# EAGLE design cd4007 (EAGLE 6.6.0)
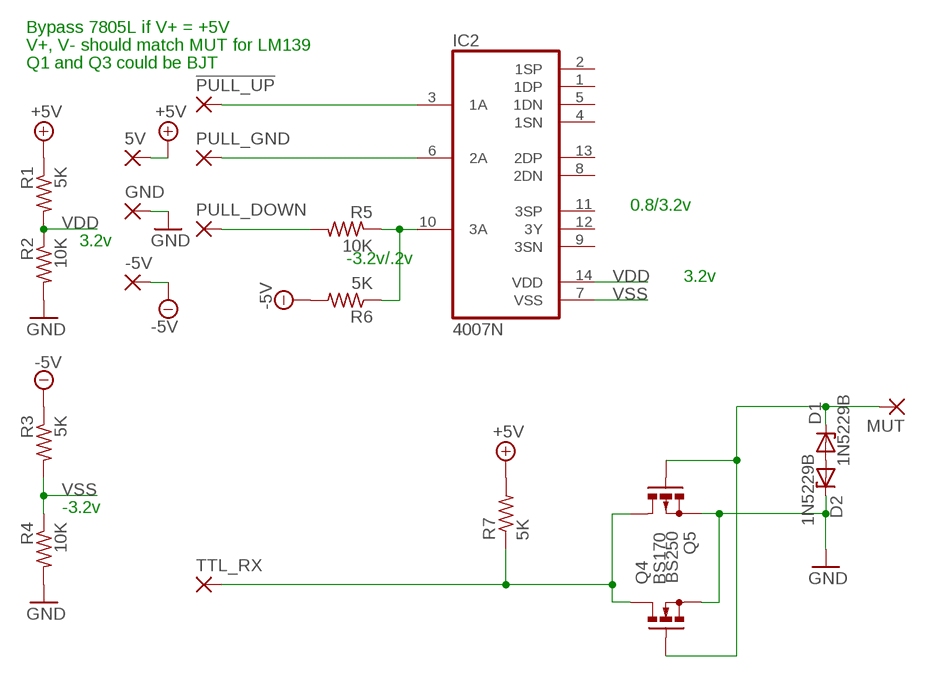
[diagram p0: schematic, sheet 1]

## Parts
5V  1,6/0,9  [1,6/0,9]
!PULL_UP  1,6/0,9  [1,6/0,9]
-5V  1,6/0,9  [1,6/0,9]
D1  1N5229B  ZENER-DIODEDO35Z10  [DO35Z10]
D2  1N5229B  ZENER-DIODEDO35Z10  [DO35Z10]
GND  1,6/0,9  [1,6/0,9]
IC2  4007N  [DIL14]
MUT  1,6/0,9  [1,6/0,9]
PULL_DOWN  1,6/0,9  [1,6/0,9]
PULL_GND  1,6/0,9  [1,6/0,9]
Q4  BS170  [SOT54E]
Q5  BS250  [SOT54E]
R1  5K  R-US_0207/10  [0207/10]
R2  10K  R-US_0207/10  [0207/10]
R3  5K  R-US_0207/10  [0207/10]
R4  10K  R-US_0207/10  [0207/10]
R5  10K  R-US_0207/10  [0207/10]
R6  5K  R-US_0207/10  [0207/10]
R7  5K  R-US_0207/10  [0207/10]
TTL_RX  1,6/0,9  [1,6/0,9]

## Nets
+5V: 5V.1(P) R1.1 R7.2
-5V: -5V.1(P) R3.1 R6.2
GND: D2.C GND.1(P) Q4.S Q5.S R2.2 R4.2
N$1: D1.C MUT.1(P) Q4.G Q5.G
N$2: IC2.10(3A) R5.1 R6.1
N$3: IC2.6(2A) PULL_GND.1(P)
N$4: PULL_DOWN.1(P) R5.2
N$7: D1.A D2.A
N$8: Q4.D Q5.D R7.1 TTL_RX.1(P)
N$10: !PULL_UP.1(P) IC2.3(1A)
VDD: IC2.14(VDD) R1.2 R2.1
VSS: IC2.7(VSS) R3.2 R4.1
Unconnected: IC2.1(1DP) IC2.2(1SP) IC2.4(1SN) IC2.5(1DN) IC2.8(2DN) IC2.9(3SN) IC2.11(3SP) IC2.12(3Y) IC2.13(2DP)

## Notes on the sheet
- Bypass 7805L if V+ = +5V
- V+, V- should match MUT for LM139
- Q1 and Q3 could be BJT
- 0.8/3.2v
- 3.2v
- -3.2v/.2v
- 3.2v
- -3.2v

## Library data of the parts
5V !PULL_UP -5V GND MUT PULL_DOWN PULL_GND TTL_RX = wirepad:1,6/0,9: THROUGH-HOLE PAD
D1 D2 = diode:ZENER-DIODE: Z-Diode
IC2 = 40xx:4007: Dual COMPLIMENTARY PAIR plus INVERTER
Q4 = transistor-small-signal:BS170: N-CHANNEL MOS FET
Q5 = transistor-small-signal:BS250: P-CHANNEL MOS FET
R1-R7 = rcl:R-US_: RESISTOR, American symbol

## Board
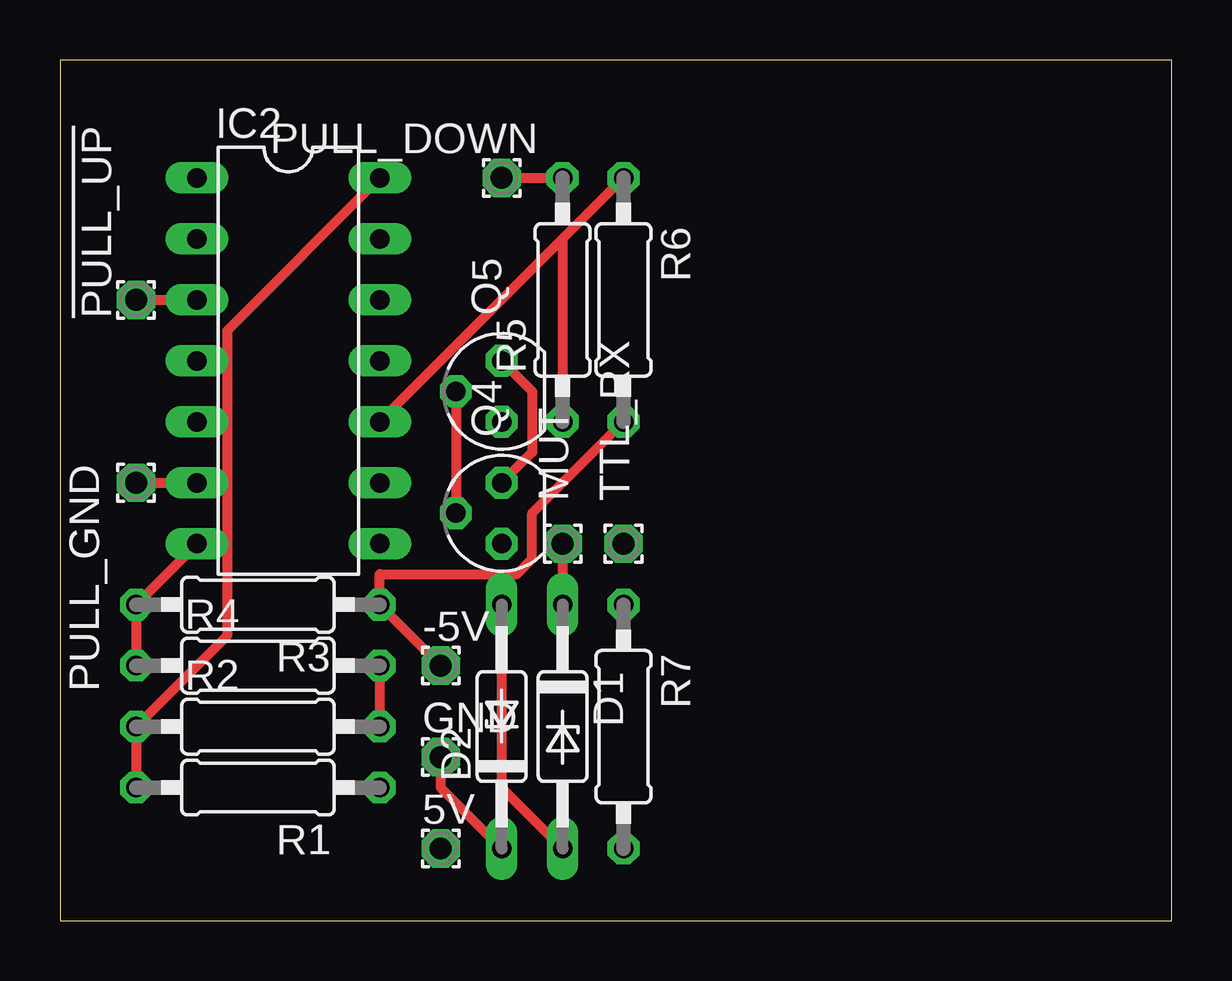
[diagram p1: board, top side]
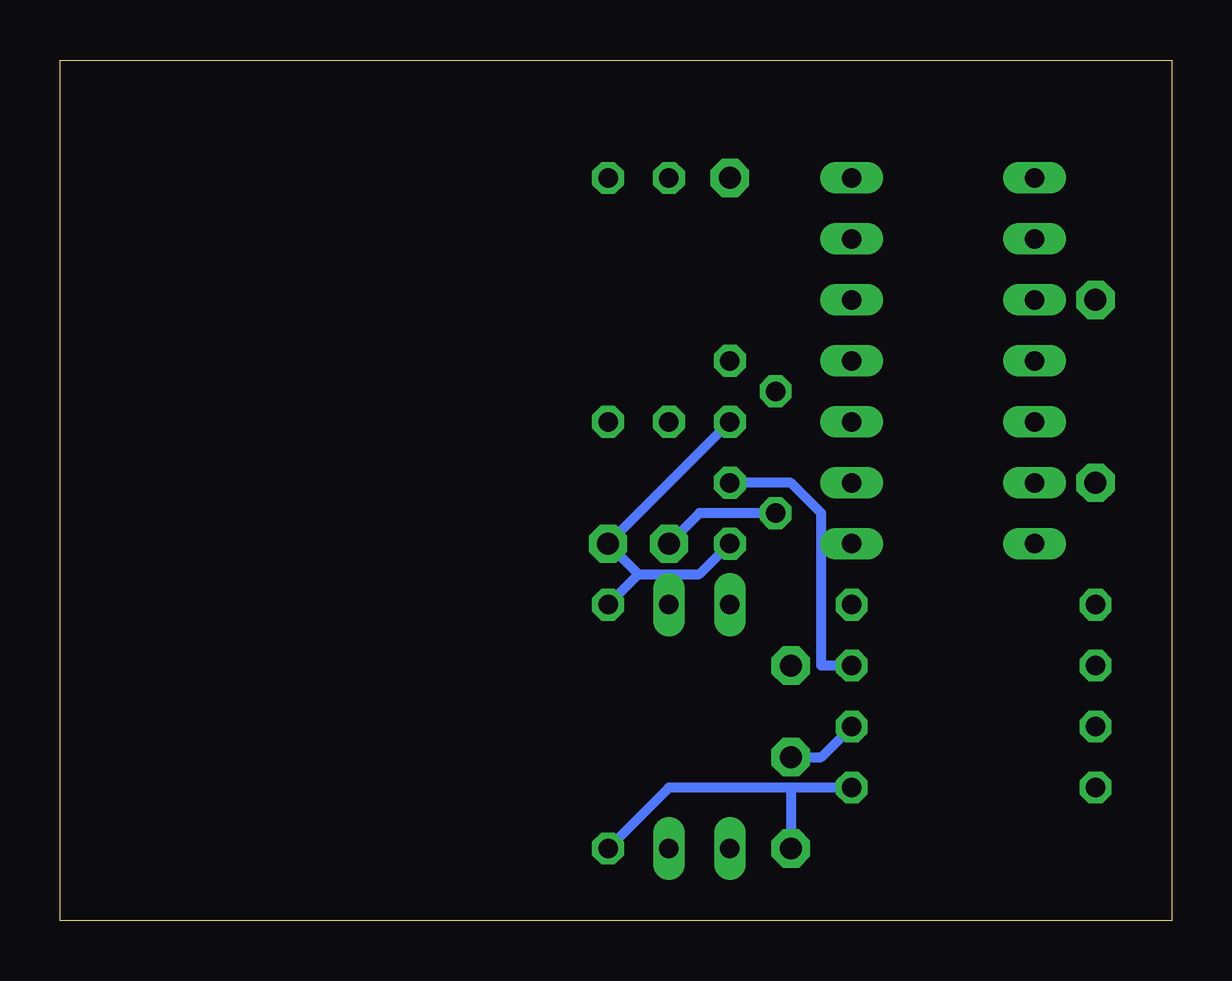
[diagram p2: board, bottom side, seen from below]

Size 46.34 x 35.87 mm. Coordinates in mm from the lower left corner, seen from the top.
Outline: 0,0 46.34,0 46.34,35.87 0,35.87 0,0
Copper layers (1+16): Top 0.035mm / dielectric 1.5mm / Bottom 0.035mm
Design rules "16mils": minimum track width 16mil, minimum drill 32mil, track to track 15mil, track to pad 10mil, pad to pad 10mil, via to via 10mil, smd to smd 10mil, copper to edge 13mil, drill to drill 10mil, minimum pad ring 10mil, minimum via ring 8mil, stop-mask expansion 0mil, vias tented up to drill 0mil, thermal gap 10mil

### Footprints (pad centres in the part's own frame; a part is rotated, then mirrored left to right if it is on the bottom)
1,6/0,9 = drill 0.914 pad 1.6 octagon: 1 0,0
DO35Z10 = drill 0.813 long: A 5.08,0; C -5.08,0
DIL14 = drill 0.813 long: 1 -7.62,-3.81; 2 -5.08,-3.81; 3 -2.54,-3.81; 4 0,-3.81; 5 2.54,-3.81; 6 5.08,-3.81; 7 7.62,-3.81; 8 7.62,3.81; 9 5.08,3.81; 10 2.54,3.81; 11 0,3.81; 12 -2.54,3.81; 13 -5.08,3.81; 14 -7.62,3.81
SOT54E = drill 0.813 octagon: D -1.27,0; G 0,1.905; S 1.27,0
0207/10 = drill 0.813 octagon: 1 -5.08,0; 2 5.08,0

### Placement (x,y rotation side)
5V  15.87,3.01 0 top
!PULL_UP  3.17,25.87 90 top
-5V  15.87,10.63 0 top
D1  20.95,8.09 270 top
D2  18.41,8.09 90 top
GND  15.87,6.82 0 top
IC2  9.52,23.33 270 top
MUT  20.95,15.71 90 top
PULL_DOWN  18.41,30.95 180 top
PULL_GND  3.17,18.25 180 top
Q4  18.41,16.98 90 top
Q5  18.41,22.06 90 top
R1  8.25,5.55 180 top
R2  8.25,8.09 0 top
R3  8.25,13.17 180 top
R4  8.25,10.63 0 top
R5  20.95,25.87 90 top
R6  23.49,25.87 270 top
R7  23.49,8.09 270 top
TTL_RX  23.49,15.71 90 top

### Tracks (layer width: path | path; a pad name or v marks a point on that pad's centre or on a via)
+5V
  Bottom 0.406: R7.2 20.95,5.55 15.87,5.55 | R1.1 15.87,5.55 | 15.87,5.55 5V.1
-5V
  Top 0.406: -5V.1 R3.1 13.33,14.44 19.04,14.44 19.68,15.08 19.68,16.98 R6.2
GND
  Top 0.406: Q4.S 19.68,19.52 19.68,22.06 Q5.S | R4.2 R2.2 | D2.C 15.87,5.55 GND.1
  Bottom 0.406: R2.2 14.6,6.82 GND.1 | Q4.S 15.87,18.25 14.6,16.98 14.6,10.63 R4.2
N$1
  Top 0.406: MUT.1 D1.C | Q5.G Q4.G
  Bottom 0.406: MUT.1 19.68,16.98 Q4.G
N$2
  Top 0.406: R6.1 20.95,28.41 | 20.95,28.41 IC2.10 | 20.95,28.41 R5.1
N$3
  Top 0.406: PULL_GND.1 IC2.6
N$4
  Top 0.406: PULL_DOWN.1 R5.2
N$7
  Top 0.406: D1.A 18.41,5.55 D2.A
N$8
  Bottom 0.406: Q4.D 19.68,14.44 22.22,14.44 | 22.22,14.44 TTL_RX.1 Q5.D | 22.22,14.44 R7.1
N$10
  Top 0.406: !PULL_UP.1 IC2.3
VDD
  Top 0.406: R1.2 R2.1 6.98,11.9 6.98,24.6 IC2.14
VSS
  Top 0.406: R4.1 R3.2 IC2.7